# EAGLE design led breakout (EAGLE 7.1.0)
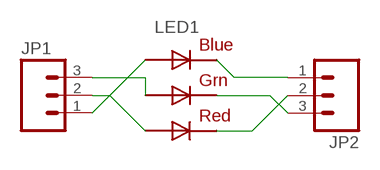
[diagram p0: schematic, sheet 1]

## Parts
JP1  M03PTH  [1X03]
JP2  M03PTH  [1X03]
LED1  RGBLED5050  [RGBLED5050]

## Nets
N$1: JP1.3 LED1.1(GREEN_A)
N$2: JP1.2 LED1.2(RED_A)
N$3: JP1.1 LED1.3(BLUE_A)
N$4: JP2.1 LED1.4(BLUE_C)
N$5: JP2.2 LED1.5(RED_C)
N$6: JP2.3 LED1.6(GREEN_C)

## Library data of the parts
JP1 JP2 = SparkFun-Connectors:M03: Header 3 Standard 3-pin 0.1" header. Use with straight break away headers (SKU : PRT-00116), right angle break away headers (PRT-00553), swiss pins (PRT-00743), machine pins (PRT-00117), and female headers (PRT-00115). Molex polarized connector foot print use with SKU : PRT-08232 with associated crimp pins and housings.
LED1 = adafruit:RGBLED: For 5050 RGB LEDs, the order of the LEDs may vary from one manufacturer to another!

## Board
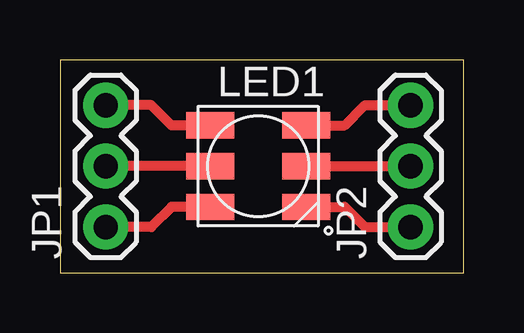
[diagram p1: board, top side]

Size 16.82 x 8.88 mm. Coordinates in mm from the lower left corner, seen from the top.
Outline: 0,0 16.82,0 16.82,8.88 0,8.88 0,0
Copper layers (1*16): Top 0.035mm / dielectric 1.5mm / Bottom 0.035mm
Design rules "default": minimum track width 10mil, minimum drill 24mil, track to track 8mil, track to pad 8mil, pad to pad 8mil, via to via 8mil, smd to smd 8mil, copper to edge 40mil, drill to drill 8mil, minimum pad ring 10mil, minimum via ring 8mil, stop-mask expansion 4mil, vias tented up to drill 0mil, thermal gap 10mil

### Footprints (pad centres in the part's own frame; a part is rotated, then mirrored left to right if it is on the bottom)
1X03 = drill 1.016 pad 1.88: 1 0,0; 2 2.54,0; 3 5.08,0
RGBLED5050 = smd 2 x 1.1: 1 -2,1.7; 2 -2,0; 3 -2,-1.7; 4 2,-1.7; 5 2,0; 6 2,1.7

### Placement (x,y rotation side)
JP1  1.91,1.91 90 top
JP2  14.61,1.91 90 top
LED1  8.26,4.45 0 top

### Tracks (layer width: path | path; a pad name or v marks a point on that pad's centre or on a via)
N$1
  Top 0.406: LED1.1 4.65,6.14 3.81,6.99 JP1.3
N$2
  Top 0.406: LED1.2 JP1.2
N$3
  Top 0.406: LED1.3 4.65,2.75 3.81,1.91 JP1.1
N$4
  Top 0.406: LED1.4 11.86,2.75 12.7,1.91 JP2.1
N$5
  Top 0.406: LED1.5 JP2.2
N$6
  Top 0.406: LED1.6 11.86,6.14 12.7,6.99 JP2.3